# EAGLE schematic BTG (EAGLE 7.7.0)
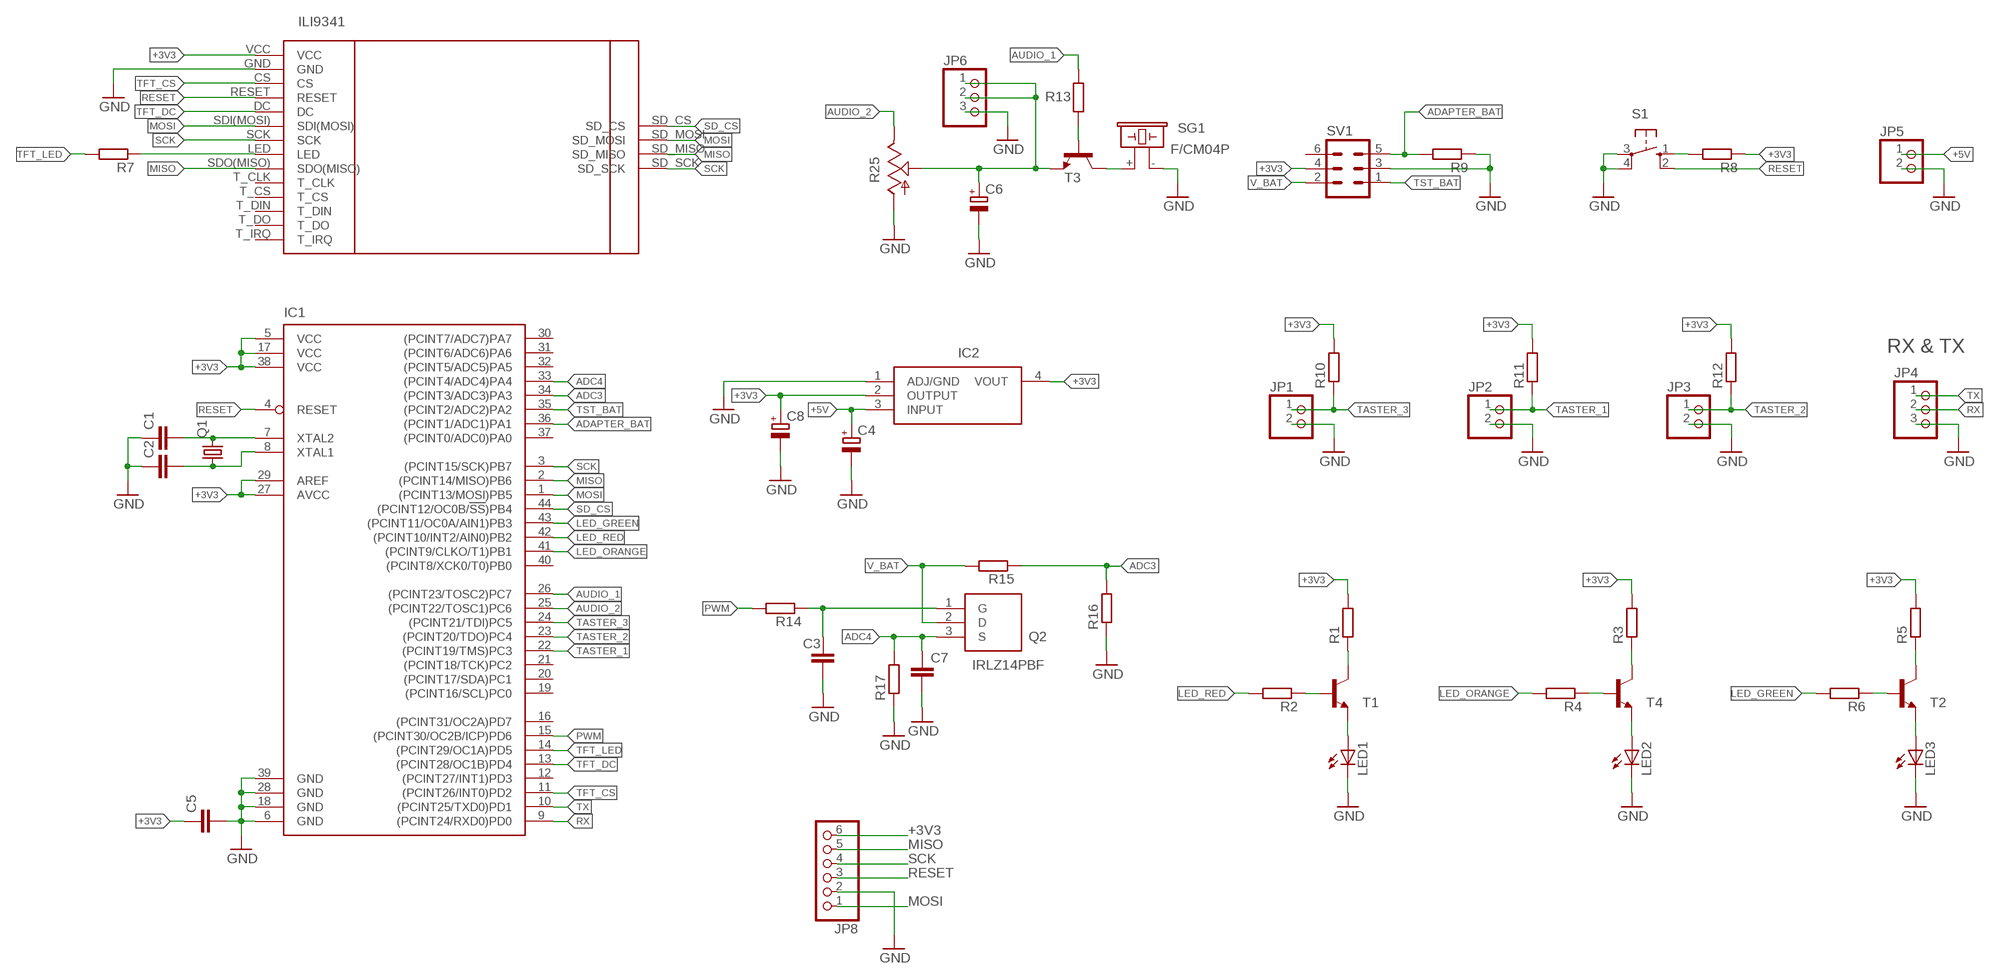
[diagram p0: schematic, sheet 1]

## Parts
C1  C-EU025-024X044  [C025-024X044]
C2  C-EU025-024X044  [C025-024X044]
C3  C-EU025-024X044  [C025-024X044]
C4  CPOL-EUSMCB  [SMC_B]
C5  C-EU050-025X075  [C050-025X075]
C6  CPOL-EUE2,5-6E  [E2,5-6E]
C7  C-EU050-025X075  [C050-025X075]
C8  CPOL-EUSMCB  [SMC_B]
IC1  ATMEGA644A  [TQFP44]
IC2  LMS8117AMP-3.3_NOPB  [SOT230P700X180-4N]
JP1  PINHD-1X2  [1X02]
JP2  PINHD-1X2  [1X02]
JP3  PINHD-1X2  [1X02]
JP4  PINHD-1X3  [1X03]
JP5  PINHD-1X2  [1X02]
JP6  PINHD-1X3  [1X03]
JP8  PINHD-1X6  [1X06]
LED1  LED5MM  [LED5MM]
LED2  LED5MM  [LED5MM]
LED3  LED5MM  [LED5MM]
Q1  CRYSTALHC49U-V  [HC49U-V]
Q2  IRLZ14PBF  [TO254P465X1031X1954-3P]
R1  R-EU_0204/7  [0204/7]
R2  R-EU_0204/7  [0204/7]
R3  R-EU_0204/7  [0204/7]
R4  R-EU_0204/7  [0204/7]
R5  R-EU_0204/7  [0204/7]
R6  R-EU_0204/7  [0204/7]
R7  R-EU_0204/7  [0204/7]
R8  R-EU_0204/7  [0204/7]
R9  R-EU_0204/7  [0204/7]
R10  R-EU_0204/7  [0204/7]
R11  R-EU_0204/7  [0204/7]
R12  R-EU_0204/7  [0204/7]
R13  R-EU_0204/7  [0204/7]
R14  R-EU_0204/7  [0204/7]
R15  R-EU_0204/7  [0204/7]
R16  R-EU_0204/7  [0204/7]
R17  R-EU_0204/7  [0204/7]
R25  TRIM_US-LI15  [LI15]
S1  10-XX  [B3F-10XX]
SG1  F/CM04P  [F/CM04P]
SV1  ML6L  [ML6L]
T1  2N3904  [TO92]
T2  2N3904  [TO92]
T3  2N3904  [TO92]
T4  2N3904  [TO92]
U$1  ILI9341  [ILI9341]

## Nets
+3V3: C5.1 C8.+ IC1.5(VCC) IC1.17(VCC) IC1.27(AVCC) IC1.29(AREF) IC1.38(VCC) IC2.2(OUTPUT) IC2.4(VOUT) JP8.6 R1.2 R3.2 R5.2 R8.1 R10.2 R11.2 R12.2 SV1.4 U$1.VCC
+5V: C4.+ IC2.3(INPUT) JP5.1
ADAPTER_BAT: IC1.36((PCINT1/ADC1)PA1) R9.2 SV1.5
ADC3: IC1.34((PCINT3/ADC3)PA3) R15.1 R16.2
ADC4: C7.1 IC1.33((PCINT4/ADC4)PA4) Q2.3(S) R17.2
AUDIO_1: IC1.26((PCINT23/TOSC2)PC7) R13.2
AUDIO_2: IC1.25((PCINT22/TOSC1)PC6) R25.E
GND: C1.1 C2.1 C3.2 C4.- C5.2 C6.- C7.2 C8.- IC1.6(GND) IC1.18(GND) IC1.28(GND) IC1.39(GND) IC2.1(ADJ/GND) JP1.2 JP2.2 JP3.2 JP4.3 JP5.2 JP6.3 JP8.2 LED1.K(C) LED2.K(C) LED3.K(C) R9.1 R16.1 R17.1 R25.A S1.3(P) S1.4(P1) SG1.- SV1.3 U$1.GND
LED_GREEN: IC1.43((PCINT11/OC0A/AIN1)PB3) R6.2
LED_ORANGE: IC1.41((PCINT9/CLKO/T1)PB1) R4.2
LED_RED: IC1.42((PCINT10/INT2/AIN0)PB2) R2.2
MISO: IC1.2((PCINT14/MISO)PB6) JP8.5 U$1.SD_MISO U$1.SDO(MISO)
MOSI: IC1.1((PCINT13/MOSI)PB5) JP8.1 U$1.SD_MOSI U$1.SDI(MOSI)
N$1: R1.1 T1.1(C)
N$2: R2.1 T1.2(B)
N$3: LED1.A T1.3(E)
N$4: LED2.A T4.3(E)
N$5: R4.1 T4.2(B)
N$6: R3.1 T4.1(C)
N$7: R5.1 T2.1(C)
N$8: R6.1 T2.2(B)
N$9: LED3.A T2.3(E)
N$10: R7.1 U$1.LED
N$11: C1.2 IC1.7(XTAL2) Q1.2
N$12: R8.2 S1.1(S)
N$13: R13.1 T3.2(B)
N$14: SG1.+ T3.1(C)
N$15: C2.2 IC1.8(XTAL1) Q1.1
N$16: C6.+ JP6.1 JP6.2 R25.S T3.3(E)
N$17: C3.1 Q2.1(G) R14.1
PWM: IC1.15((PCINT30/OC2B/ICP)PD6) R14.2
RESET: IC1.4(RESET) JP8.3 S1.2(S1) U$1.RESET
RX: IC1.9((PCINT24/RXD0)PD0) JP4.2
SCK: IC1.3((PCINT15/SCK)PB7) JP8.4 U$1.SCK U$1.SD_SCK
SD_CS: IC1.44((PCINT12/OC0B/!SS!)PB4) U$1.SD_CS
TASTER_1: IC1.22((PCINT19/TMS)PC3) JP2.1 R11.1
TASTER_2: IC1.23((PCINT20/TDO)PC4) JP3.1 R12.1
TASTER_3: IC1.24((PCINT21/TDI)PC5) JP1.1 R10.1
TFT_CS: IC1.11((PCINT26/INT0)PD2) U$1.CS
TFT_DC: IC1.13((PCINT28/OC1B)PD4) U$1.DC
TFT_LED: IC1.14((PCINT29/OC1A)PD5) R7.2
TST_BAT: IC1.35((PCINT2/ADC2)PA2) SV1.1
TX: IC1.10((PCINT25/TXD0)PD1) JP4.1
V_BAT: Q2.2(D) R15.2 SV1.2
Unconnected: IC1.12((PCINT27/INT1)PD3) IC1.16((PCINT31/OC2A)PD7) IC1.19((PCINT16/SCL)PC0) IC1.20((PCINT17/SDA)PC1) IC1.21((PCINT18/TCK)PC2) IC1.30((PCINT7/ADC7)PA7) IC1.31((PCINT6/ADC6)PA6) IC1.32((PCINT5/ADC5)PA5) IC1.37((PCINT0/ADC0)PA0) IC1.40((PCINT8/XCK0/T0)PB0) SV1.6 U$1.T_CLK U$1.T_CS U$1.T_DIN U$1.T_DO U$1.T_IRQ

## Notes on the sheet
- RX & TX

## Library data of the parts
C1-C3 C5 C7 = resistor:C-EU: CAPACITOR, European symbol
C4 C6 C8 = rcl:CPOL-EU: POLARIZED CAPACITOR, European symbol
IC1 = atmel:ATMEGA644: 8-bit Microcontroller with 64K Bytes In-System Programmable Flash Source: http://www.atmel.com/dyn/resources/prod_documents/doc2593.pdf; MPN: ATMEGA644PV-10AU; OC_FARNELL: 1455123; OC_NEWARK: 58M3748
IC2 = LMS8117AMP-3.3_NOPB:LMS8117AMP-3.3_NOPB: LMS8117AMP-3.3/NOPB, Low Dropout Voltage Regulator, 1A, 3.3 V +/-1%, 2.5 15 Vin, 4-Pin SOT-223 Source: Datasheet <http://docs-emea.rs-online.com/webdocs/06f0/0900766b806f0dfb.pdf>; DESCRIPTION: LMS8117AMP-3.3/NOPB, Low Dropout Voltage Regulator, 1A, 3.3 V +/-1%, 2.5 15 Vin, 4-Pin SOT-223; HEIGHT: 1.8mm; MANUFACTURER_NAME: Texas Instruments; MANUFACTURER_PART_NUMBER: LMS8117AMP-3.3/NOPB; MOUSER_PART_NUMBER: 926-LMS8117AMP33NOPB; MOUSER_PRICE-STOCK: https://www.mouser.com/Search/Refine.aspx?Keyword=926-LMS8117AMP33NOPB; RS_PART_NUMBER: 5360313P; RS_PRICE-STOCK: http://uk.rs-online.com/web/p/products/5360313P
JP1-JP3 JP5 = pinhead:PINHD-1X2: PIN HEADER
JP4 JP6 = pinhead:PINHD-1X3: PIN HEADER
JP8 = pinhead:PINHD-1X6: PIN HEADER
LED1-LED3 = led:LED: LED OSRAM: - CHIPLED LG R971, LG N971, LY N971, LG Q971, LY Q971, LO R971, LY R971 LH N974, LH R974 LS Q976, LO Q976, LY Q976 LO Q996 - Hyper CHIPLED LW Q18S LB Q993, LB Q99A, LB R99A - SideLED LS A670, LO A670, LY A670, LG A670, LP A670 LB A673, LV A673, LT A673, LW A673 LH A674 LY A675 LS A676, LA A676, LO A676, LY A676, LW A676 LS A679, LY A679, LG A679 - Hyper Micro SIDELED® LS Y876, LA Y876, LO Y876, LY Y876 LT Y87S - SmartLED LW L88C, LW L88S LB L89C, LB L89S, LG L890 LS L89K, LO L89K, LY L89K LS L896, LA L896, LO L896, LY L896 - TOPLED LS T670, LO T670, LY T670, LG T670, LP T670 LSG T670, LSP T670, LSY T670, LOP T670, LYG T670 LG T671, LOG T671, LSG T671 LB T673, LV T673, LT T673, LW T673 LH T674 LS T676, LA T676, LO T676, LY T676, LB T676, LH T676, LSB T676, LW T676 LB T67C, LV T67C, LT T67C, LS T67K, LO T67K, LY T67K, LW E67C LS E67B, LA E67B, LO E67B, LY E67B, LB E67C, LV E67C, LT E67C LW T67C LS T679, LY T679, LG T679 LS T770, LO T770, LY T770, LG T770, LP T770 LB T773, LV T773, LT T773, LW T773 LH T774 LS E675, LA E675, LY E675, LS T675 LS T776, LA T776, LO T776, LY T776, LB T776 LHGB T686 LT T68C, LB T68C - Hyper Mini TOPLED® LB M676 - Mini TOPLED Santana® LG M470 LS M47K, LO M47K, LY M47K Source: http://www.osram.convergy.de LUXEON: - LUMILED® LXK2-PW12-R00, LXK2-PW12-S00, LXK2-PW14-U00, LXK2-PW14-V00 LXK2-PM12-R00, LXK2-PM12-S00, LXK2-PM14-U00 LXK2-PE12-Q00, LXK2-PE12-R00, LXK2-PE12-S00, LXK2-PE14-T00, LXK2-PE14-U00 LXK2-PB12-K00, LXK2-PB12-L00, LXK2-PB12-M00, LXK2-PB14-N00, LXK2-PB14-P00, LXK2-PB14-Q00 LXK2-PR12-L00, LXK2-PR12-M00, LXK2-PR14-Q00, LXK2-PR14-R00 LXK2-PD12-Q00, LXK2-PD12-R00, LXK2-PD12-S00 LXK2-PH12-R00, LXK2-PH12-S00 LXK2-PL12-P00, LXK2-PL12-Q00, LXK2-PL12-R00 Source: www.luxeon.com KINGBRIGHT: KA-3528ASYC Source: www.kingbright.com
Q1 = crystal:CRYSTAL: CRYSTAL; OC_FARNELL: 1666969; OC_NEWARK: unknown
Q2 = IRLZ14PBF:IRLZ14PBF: N-channel logicFET,IRLZ14 10A 60V Source: Datasheet <http://docs-emea.rs-online.com/webdocs/0791/0900766b807913cc.pdf>; ARROW_PART_NUMBER: IRLZ14PBF; ARROW_PRICE-STOCK: https://www.arrow.com/en/products/irlz14pbf/vishay; DESCRIPTION: N-channel logicFET,IRLZ14 10A 60V; HEIGHT: 4.65mm; MANUFACTURER_NAME: Vishay; MANUFACTURER_PART_NUMBER: IRLZ14PBF; MOUSER_PART_NUMBER: 844-IRLZ14PBF; MOUSER_PRICE-STOCK: https://www.mouser.co.uk/ProductDetail/Vishay-Semiconductors/IRLZ14PBF?qs=cvaI6ThkwxuEdeJ8YmO4Qg%3D%3D
R1-R17 = rcl:R-EU_: RESISTOR, European symbol
R25 = pot:TRIM_US-: POTENTIOMETER
S1 = switch-omron:10-XX: OMRON SWITCH; MPN: B3F-1000; OC_FARNELL: 176432; OC_NEWARK: 36M3542
SG1 = buzzer:F/CM04P: BUZZER Source: Buerklin; OC_FARNELL: unknown; OC_NEWARK: unknown
SV1 = con-ml:ML6L: HARTING; OC_FARNELL: unknown; OC_NEWARK: unknown
T1-T4 = transistor:2N3904: NPN TRANSISTOR
U$1 = ILI9341:ILI9341